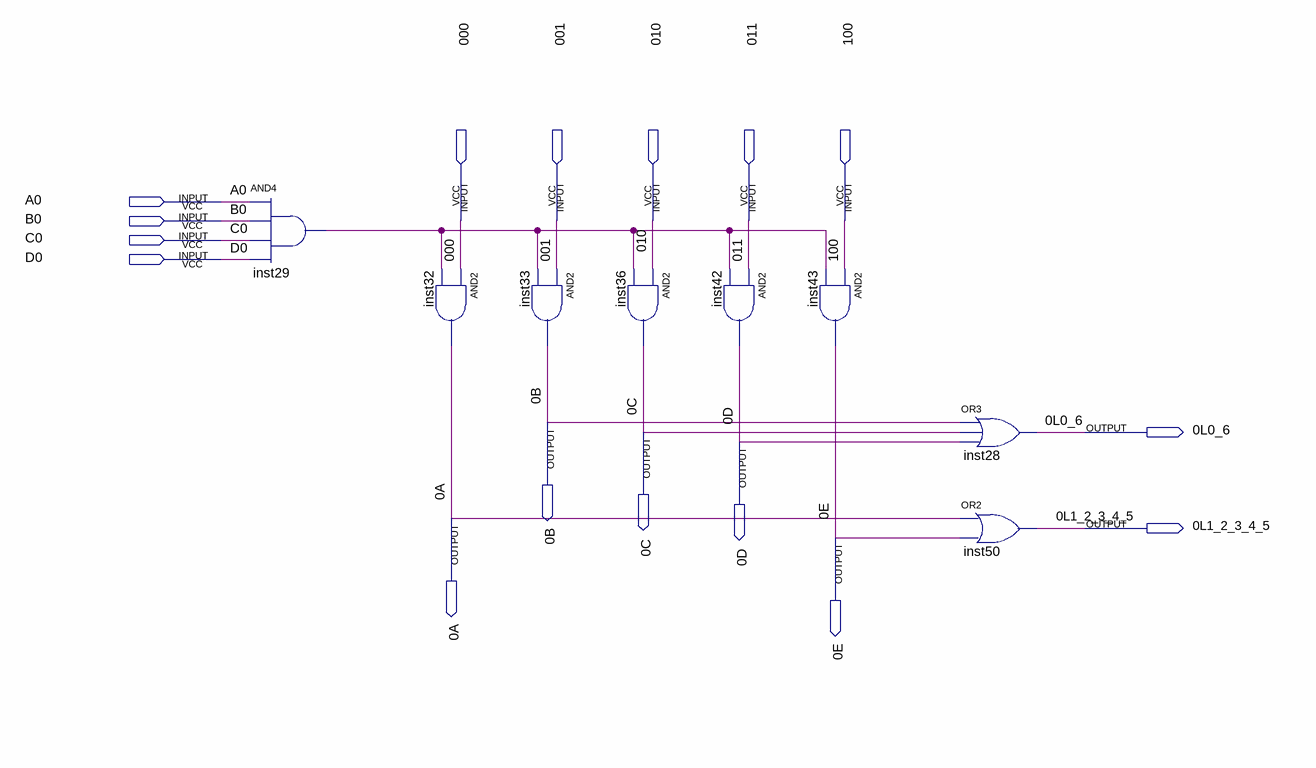
[diagram p0: schematic sheet]
// Quartus schematic carac0.bdf as structural Verilog: 8 symbols, 16 pins
module carac0 (
  input  A0,
  input  B0,
  input  \000 ,
  input  \001 ,
  input  \010 ,
  input  \011 ,
  input  \100 ,
  input  C0,
  input  D0,
  output \0B ,
  output \0C ,
  output \0L0_6 ,
  output \0D ,
  output \0A ,
  output \0L1_2_3_4_5 ,
  output \0E 
);

  wire inst29_out;

  and inst29 (inst29_out, A0, B0, C0, D0);
  and inst32 (\0A , \000 , inst29_out);
  and inst33 (\0B , \001 , inst29_out);
  and inst36 (\0C , \010 , inst29_out);
  and inst42 (\0D , \011 , inst29_out);
  and inst43 (\0E , \100 , inst29_out);
  or inst28 (\0L0_6 , \0B , \0C , \0D );
  or inst50 (\0L1_2_3_4_5 , \0A , \0E );
endmodule
